# Altium schematic sheet SAMA7D65_MPU.SchDoc
size 420 x 297 mm; SheetNumber: 7; SheetTotal: 23
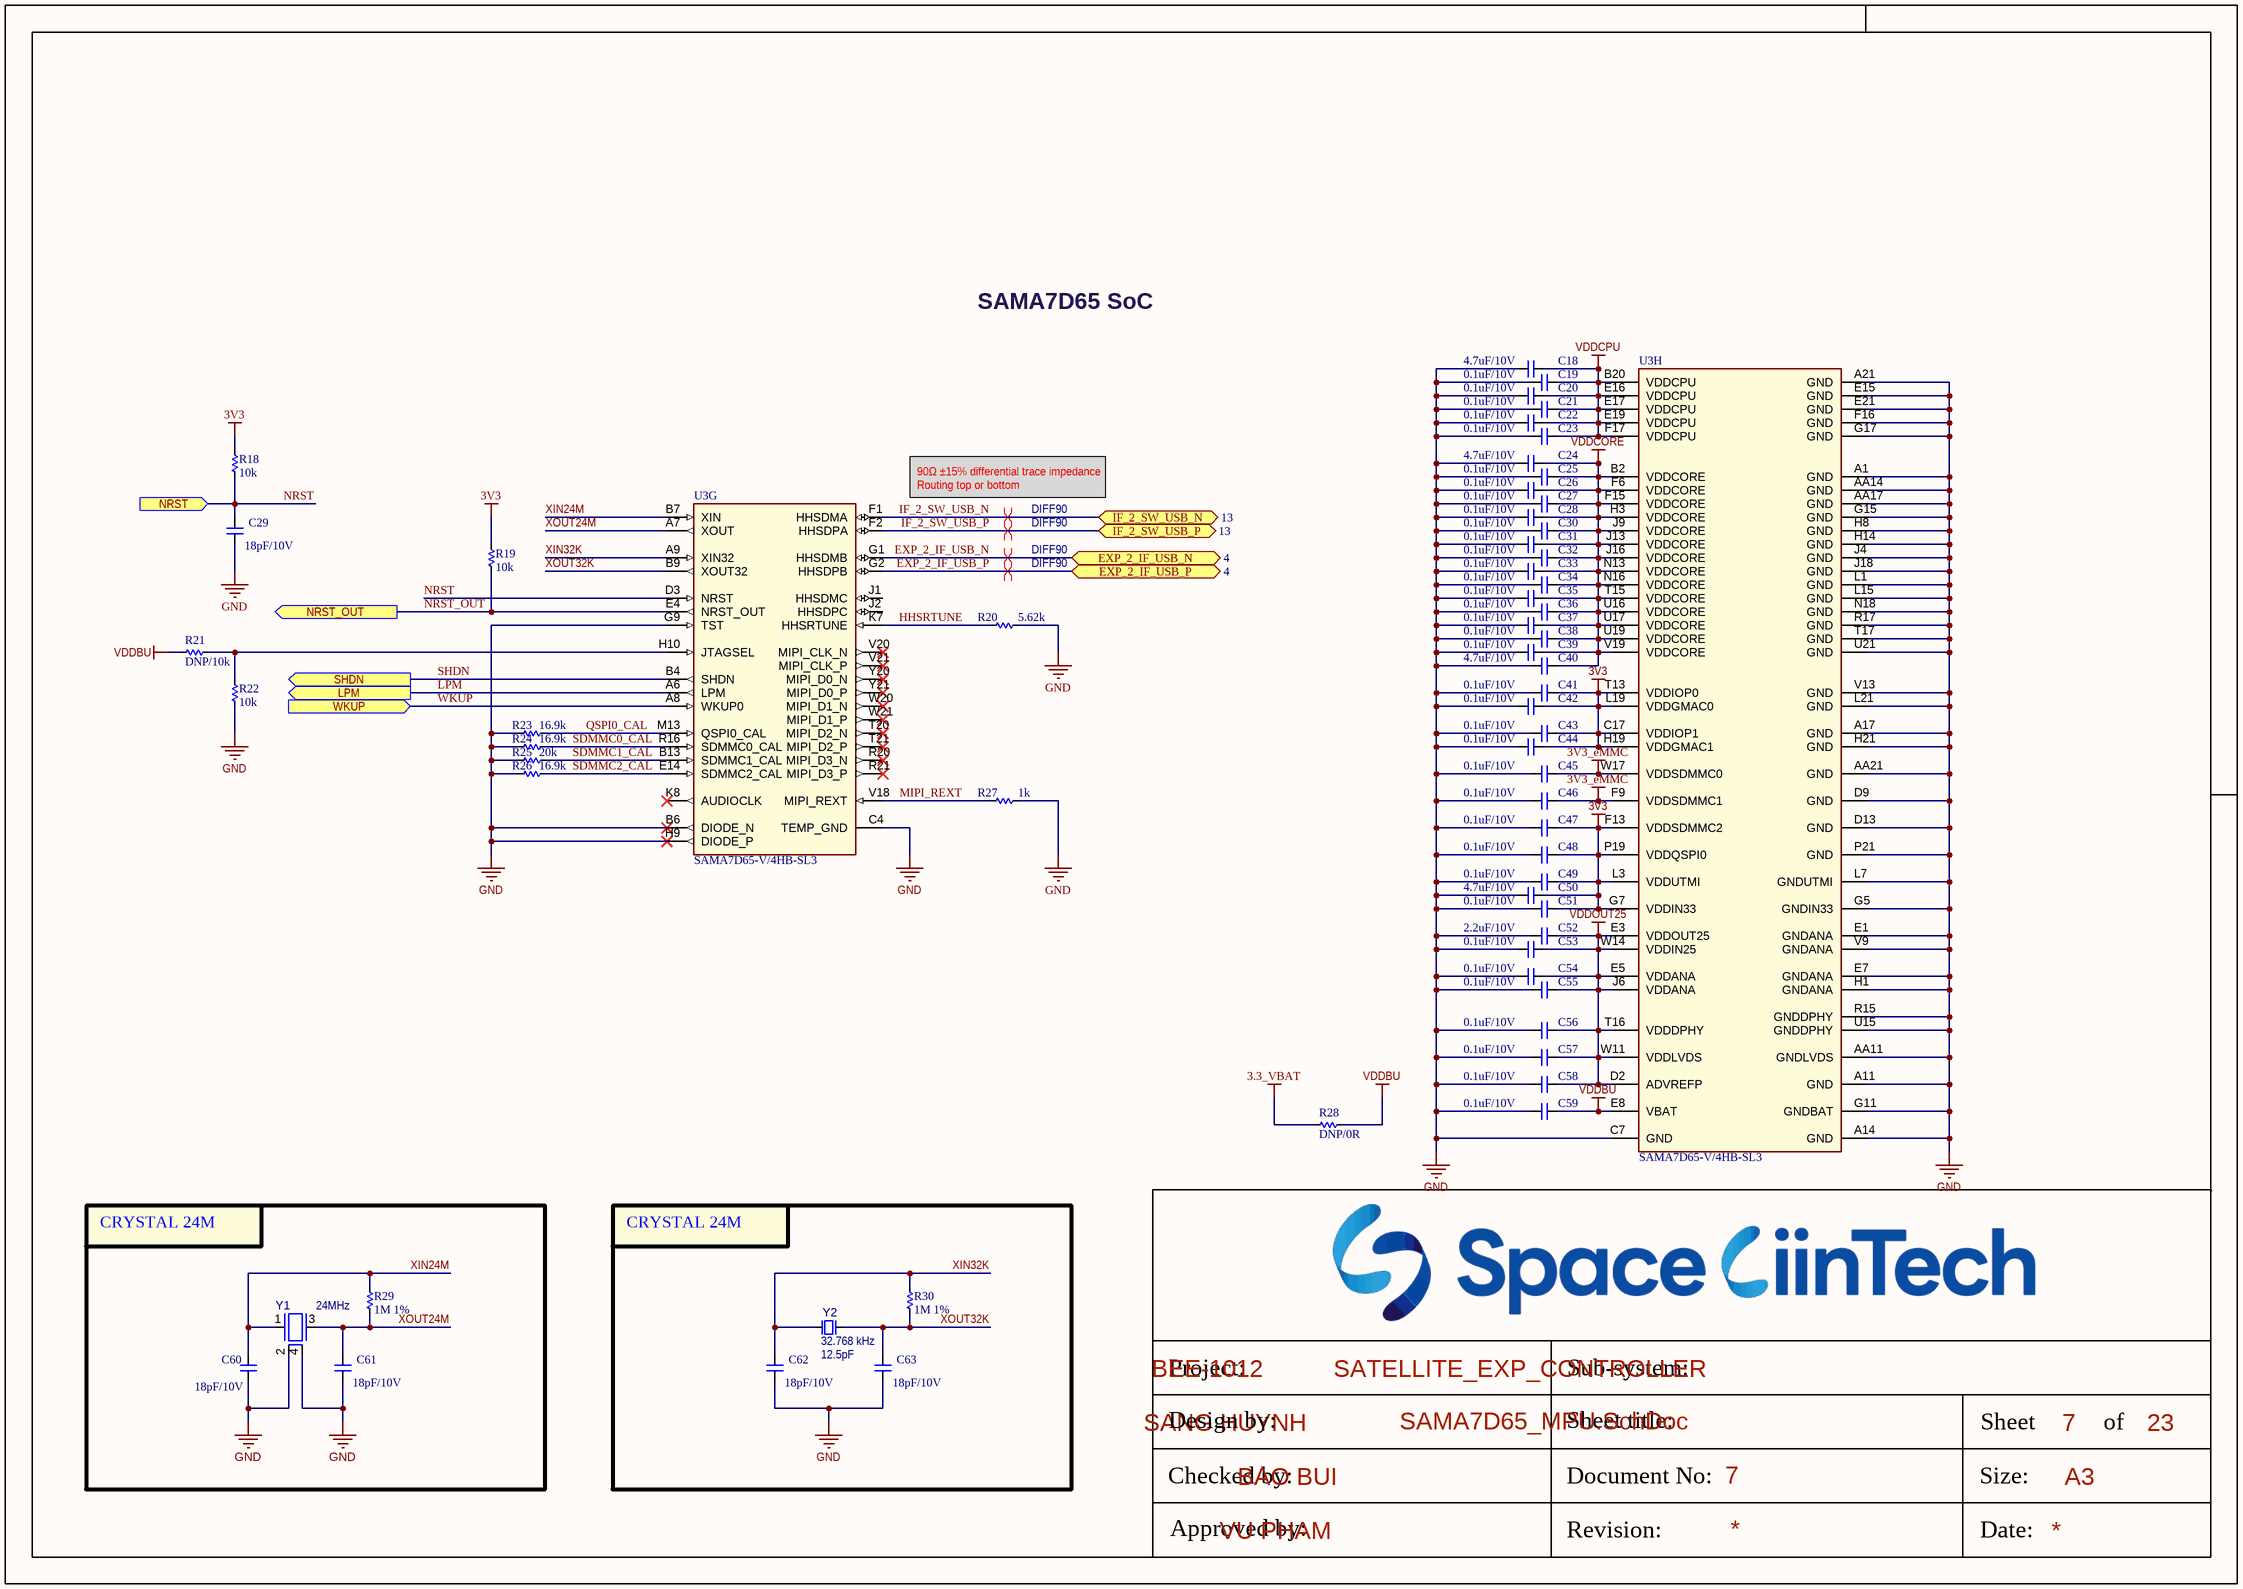
[diagram p0: SAMA7D65_MPU.SchDoc]

## Parts
C18  4.7uF/10V  [CAP_C_1005X50_L]
C19  0.1uF/10V  [CAP_C_0603x30]
C20  0.1uF/10V  [CAP_C_0603x30]
C21  0.1uF/10V  [CAP_C_0603x30]
C22  0.1uF/10V  [CAP_C_0603x30]
C23  0.1uF/10V  [CAP_C_0603x30]
C24  4.7uF/10V  [CAP_C_1005X50_L]
C25  0.1uF/10V  [CAP_C_0603x30]
C26  0.1uF/10V  [CAP_C_0603x30]
C27  0.1uF/10V  [CAP_C_0603x30]
C28  0.1uF/10V  [CAP_C_0603x30]
C29  18pF/10V  [CAP_C_0603x30]
C30  0.1uF/10V  [CAP_C_0603x30]
C31  0.1uF/10V  [CAP_C_0603x30]
C32  0.1uF/10V  [CAP_C_0603x30]
C33  0.1uF/10V  [CAP_C_0603x30]
C34  0.1uF/10V  [CAP_C_0603x30]
C35  0.1uF/10V  [CAP_C_0603x30]
C36  0.1uF/10V  [CAP_C_0603x30]
C37  0.1uF/10V  [CAP_C_0603x30]
C38  0.1uF/10V  [CAP_C_0603x30]
C39  0.1uF/10V  [CAP_C_0603x30]
C40  4.7uF/10V  [CAP_C_1005X50_L]
C41  0.1uF/10V  [CAP_C_0603x30]
C42  0.1uF/10V  [CAP_C_0603x30]
C43  0.1uF/10V  [CAP_C_0603x30]
C44  0.1uF/10V  [CAP_C_0603x30]
C45  0.1uF/10V  [CAP_C_0603x30]
C46  0.1uF/10V  [CAP_C_0603x30]
C47  0.1uF/10V  [CAP_C_0603x30]
C48  0.1uF/10V  [CAP_C_0603x30]
C49  0.1uF/10V  [CAP_C_0603x30]
C50  4.7uF/10V  [CAP_C_1005X50_L]
C51  0.1uF/10V  [CAP_C_0603x30]
C52  2.2uF/10V  [CAP_C_1005X50_L]
C53  0.1uF/10V  [CAP_C_0603x30]
C54  0.1uF/10V  [CAP_C_0603x30]
C55  0.1uF/10V  [CAP_C_0603x30]
C56  0.1uF/10V  [CAP_C_0603x30]
C57  0.1uF/10V  [CAP_C_0603x30]
C58  0.1uF/10V  [CAP_C_0603x30]
C59  0.1uF/10V  [CAP_C_0603x30]
C60  18pF/10V  [CAP_C_0603x30]
C61  18pF/10V  [CAP_C_0603x30]
C62  18pF/10V  [CAP_C_0603x30]
C63  18pF/10V  [CAP_C_0603x30]
R18  10k  [RES_C_0603X30]
R19  10k  [RES_C_0603X30]
R20  5.62k  [RES_C_0603X30]
R21  DNP/10k  [RES_C_0603X30]
R22  10k  [RES_C_0603X30]
R23  16.9k  [RES_C_0603X30]
R24  16.9k  [RES_C_0603X30]
R25  20k  [RES_C_0603X30]
R26  16.9k  [RES_C_0603X30]
R27  1k  [RES_C_0603X30]
R28  DNP/0R  [RES_C_1005x30_L]
R29  1M 1%  [RES_C_1005x30_L]
R30  1M 1%  [RES_C_1005x30_L]
U3  value SAMA7D65-V/4HB-SL3  [TFBGA-343_14x14]  (hidden comment: SAMA7D65)  (parts G,H of 8)
Y1  value 24MHz  [XTAL_ECS2401037B2JTNTR]  (hidden comment: Crystal 4 Pins)
Y2  value 32.768 kHz  Load Capacitance: 12.5pF  [CRYSTAL_FC-12M_L2.05W1.2H0.6]  (hidden comment: Crystal 2 Pins)

## Blocks framed on the sheet
CRYSTAL 24M: C60 C61 R29 Y1
CRYSTAL 24M: C62 C63 R30 Y2

## Ports
EXP_2_IF_USB_N (bidir, see 4), EXP_2_IF_USB_P (bidir, see 4), IF_2_SW_USB_N (bidir, see 13), IF_2_SW_USB_P (bidir, see 13), LPM (out, see 6), NRST (in, see 6, 17, 22), NRST_OUT (out), SHDN (out, see 6), WKUP (in, see 6)

## Nets
3.3_VBAT: R28.1
3V3: C41.2 C42.2 C43.2 C44.2 C47.2 C48.2 C49.2 C50.2 C51.2 R18.1 R19.1 U3.C17(VDDIOP1) U3.F13(VDDSDMMC2) U3.G7(VDDIN33) U3.H19(VDDGMAC1) U3.L3(VDDUTMI) U3.L19(VDDGMAC0) U3.P19(VDDQSPI0) U3.T13(VDDIOP0)
3V3_eMMC: C45.2 C46.2 U3.F9(VDDSDMMC1) U3.W17(VDDSDMMC0)
GND: C18.1 C19.1 C20.1 C21.1 C22.1 C23.1 C24.1 C25.1 C26.1 C27.1 C28.1 C29.2 C30.1 C31.1 C32.1 C33.1 C34.1 C35.1 C36.1 C37.1 C38.1 C39.1 C40.1 C41.1 C42.1 C43.1 C44.1 C45.1 C46.1 C47.1 C48.1 C49.1 C50.1 C51.1 C52.1 C53.1 C54.1 C55.1 C56.1 C57.1 C58.1 C59.1 C60.2 C61.2 C62.2 C63.2 R20.2 R22.1 R23.1 R24.1 R25.1 R26.1 R27.2 U3.A1(GND) U3.A11(GND) U3.A14(GND) U3.A17(GND) U3.A21(GND) U3.AA11(GNDLVDS) U3.AA14(GND) U3.AA17(GND) U3.AA21(GND) U3.B6(DIODE_N) U3.C4(TEMP_GND) U3.C7(GND) U3.D9(GND) U3.D13(GND) U3.E1(GNDANA) U3.E7(GNDANA) U3.E15(GND) U3.E21(GND) U3.F16(GND) U3.G5(GNDIN33) U3.G9(TST) U3.G11(GNDBAT) U3.G15(GND) U3.G17(GND) U3.H1(GNDANA) U3.H8(GND) U3.H9(DIODE_P) U3.H14(GND) U3.H21(GND) U3.J4(GND) U3.J18(GND) U3.L1(GND) U3.L7(GNDUTMI) U3.L15(GND) U3.L21(GND) U3.N18(GND) U3.P21(GND) U3.R15(GNDDPHY) U3.R17(GND) U3.T17(GND) U3.U15(GNDDPHY) U3.U21(GND) U3.V9(GNDANA) U3.V13(GND) Y1.2(GND) Y1.4(GND)
VDDBU: C59.2 R21.2 R28.2 U3.E8(VBAT)
VDDCORE: C24.2 C25.2 C26.2 C27.2 C28.2 C30.2 C31.2 C32.2 C33.2 C34.2 C35.2 C36.2 C37.2 C38.2 C39.2 C40.2 U3.B2(VDDCORE) U3.F6(VDDCORE) U3.F15(VDDCORE) U3.H3(VDDCORE) U3.J9(VDDCORE) U3.J13(VDDCORE) U3.J16(VDDCORE) U3.N13(VDDCORE) U3.N16(VDDCORE) U3.T15(VDDCORE) U3.U16(VDDCORE) U3.U17(VDDCORE) U3.U19(VDDCORE) U3.V19(VDDCORE)
VDDCPU: C18.2 C19.2 C20.2 C21.2 C22.2 C23.2 U3.B20(VDDCPU) U3.E16(VDDCPU) U3.E17(VDDCPU) U3.E19(VDDCPU) U3.F17(VDDCPU)
VDDOUT25: C52.2 C53.2 C54.2 C55.2 C56.2 C57.2 C58.2 U3.D2(ADVREFP) U3.E3(VDDOUT25) U3.E5(VDDANA) U3.J6(VDDANA) U3.T16(VDDDPHY) U3.W11(VDDLVDS) U3.W14(VDDIN25)
EXP_2_IF_USB_N: U3.G1(HHSDMB) ; port EXP_2_IF_USB_N
EXP_2_IF_USB_P: U3.G2(HHSDPB) ; port EXP_2_IF_USB_P
HHSRTUNE: R20.1 U3.K7(HHSRTUNE)
IF_2_SW_USB_N: U3.F1(HHSDMA) ; port IF_2_SW_USB_N
IF_2_SW_USB_P: U3.F2(HHSDPA) ; port IF_2_SW_USB_P
LPM: U3.A6(LPM) ; port LPM
MIPI_REXT: R27.1 U3.V18(MIPI_REXT)
NRST: C29.1 R18.2 U3.D3(NRST) ; port NRST
NRST_OUT: R19.2 U3.E4(NRST_OUT) ; port NRST_OUT
QSPI0_CAL: R23.2 U3.M13(QSPI0_CAL)
SDMMC0_CAL: R24.2 U3.R16(SDMMC0_CAL)
SDMMC1_CAL: R25.2 U3.B13(SDMMC1_CAL)
SDMMC2_CAL: R26.2 U3.E14(SDMMC2_CAL)
SHDN: U3.B4(SHDN) ; port SHDN
WKUP: U3.A8(WKUP0) ; port WKUP
XIN24M: C60.1 R29.2 U3.B7(XIN) Y1.1(Osc1)
XIN32K: C62.1 R30.2 U3.A9(XIN32) Y2.1(Osc1)
XOUT24M: C61.1 R29.1 U3.A7(XOUT) Y1.3(Osc2)
XOUT32K: C63.1 R30.1 U3.B9(XOUT32) Y2.2(Osc2)
NetR21_1: R21.1 R22.2 U3.H10(JTAGSEL)

Not connected (* = marked no-connect by the designer): U3 J1(HHSDMC) J2(HHSDPC) K8(AUDIOCLK)* R20(MIPI_D3_N)* R21(MIPI_D3_P)* T20(MIPI_D2_N)* T21(MIPI_D2_P)* V20(MIPI_CLK_N)* V21(MIPI_CLK_P)* W20(MIPI_D1_N)* W21(MIPI_D1_P)* Y20(MIPI_D0_N)* Y21(MIPI_D0_P)*

## Layout directives
differential pair; differential pair class DIFF90; net class DIFF90; rule Matched Net Lengths [Tolerance = 4mil]: EXP_2_IF_USB_N, EXP_2_IF_USB_P, IF_2_SW_USB_N, IF_2_SW_USB_P

## Notes on the sheet
- SAMA7D65 SoC
- 90Ω ±15% differential trace impedance
  Routing top or bottom
- Project:
- BEE-1012
- Sub-system:
- SATELLITE_EXP_CONTROLLER
- Design by:
- SANG HUYNH
- BAO BUI
- Sheet title:
- Sheet
- A3
- of
- Checked by:
- Approved by:
- VU PHAM
- Revision:
- Document No:
- Size:
- Date:

## Library data of the parts
C18-C63 = _CAP_C_2: CAP CHIP
R18-R30 = _RES_B_2: RES
U3 = SAMA7D65: SAMA7D65 MPU 1000MHz Cortex-A7 TFBGA-343; Manufacturer 1: Microchip Technology; Description_: MCHP MPU 32-BIT Cortex-A7 1000MHz 128kB SAMA7D65-V/4HB-SL3 TFBGA-343; Populated: YES; MCHP-ID: IC2674; Symbol: SAMA7D65-TFBGA-343; Dev Tools Status: Design; Owner: Ciprian Abramov; Restricted Sourcing: No; Manufacturer Part Number 1: SAMA7D65-V/4HB-SL3; Type: 32-Bit MPU; Status: MCL Design; Revision: 1; Category: MCHP-Microcontroller; ComponentLink1URL: https://www.microchip.com/sitesearch/search/Product%20and%20Development%20Tools/SAMA7D65-V/4HB-SL3; ComponentLink1Description: SVN Datasheet; ComponentLink2Description: Local Datasheet; ComponentLink3URL: C:\ALTIUM_WORK\00001_MCHP-CDB\Library\LibraryRefs\SAMA7D65-TFBGA-343.SchLib; ComponentLink3Description: Open Symbol; ComponentLink4URL: C:\ALTIUM_WORK\00001_MCHP-CDB\Library\Footprints\TFBGA-343_14x14.PcbLib; ComponentLink4Description: Open Footprint; ComponentLink5Description: Open Footprint 2; ComponentLink6Description: Open Footprint 3; ComponentLink7Description: Open Footprint 4; Supplier 1: Microchip Technology; Supplier Part Number 1: SAMA7D65-V/4HB-SL3; Operating Temperature: -40C to +105C; Quantity Override: 1
Y1 = ECS-240-10-37B2-JTN-TR: CRYSTAL 24 MHZ 10PF SMD; Manufacturer 1: ECS Inc; MCHP-ID: OSC1299; Description_: CRYSTAL 24MHz 10pF SMD L2W1.6H0.5; Dev Tools Status: Design; Owner: Ciprian Abramov; Tolerance: 20ppm; Populated: YES; Revision: 1; Symbol: Crystal 4 Pins; Status: MCL Design; ComponentLink1URL: https://chn-vm-apps.microchip.com/mchprepo/parts/Datasheets/ECX-1637B2.pdf; ComponentLink1Description: SVN Datasheet; ComponentLink2URL: C:\ALTIUM_WORK\00001_MCHP-CDB\Datasheets\ECX-1637B2.pdf; ComponentLink2Description: Local Datasheet; ComponentLink3URL: C:\ALTIUM_WORK\00001_MCHP-CDB\Library\LibraryRefs\Crystal 4 Pins.SchLib; ComponentLink3Description: Open Symbol; ComponentLink4URL: C:\ALTIUM_WORK\00001_MCHP-CDB\Library\Footprints\CRYSTAL_L2.0W1.6H0.5_FA-128.PcbLib; ComponentLink4Description: Open Footprint; ComponentLink5Description: Open Footprint 2; ComponentLink6Description: Open Footprint 3; ComponentLink7Description: Open Footprint 4; Operating Temperature: -40C to +85C; Package: L2.0W1.6H0.5; Type: Crystal; Category: Crystal/Oscillator; Load Capacitance: 10pF; Manufacturer Part Number 1: ECS-240-10-37B2-JTN-TR; Supplier 1: Digi-Key; Supplier Part Number 1: 50-ECS-240-10-37B2-JTN-TR-ND; Quantity Override: 1
Y2 = FC-12M 32.7680KA-A3: CRYSTAL 32.7680KHZ 12.5PF SMD; Manufacturer 1: Epson; MCHP-ID: OSC1269; Description_: CRYSTAL 32.768KHZ 12.5PF SMD 2-SMD, No Lead, FC-12M 32.7680KA-A3; Dev Tools Status: Design; Owner: Dragos Danaila; Tolerance: 20ppm; Populated: YES; Revision: 1; Symbol: Crystal 2 Pins; Status: MCL Design; ComponentLink1URL: https://chn-vm-apps.microchip.com/mchprepo/parts/Datasheets/FC-12D_en.pdf; ComponentLink1Description: SVN Datasheet; ComponentLink2URL: C:\ALTIUM_WORK\00001_MCHP-CDB\Datasheets\FC-12D_en.pdf; ComponentLink2Description: Local Datasheet; ComponentLink3URL: C:\ALTIUM_WORK\00001_MCHP-CDB\Library\LibraryRefs\Crystal 2 Pins.SchLib; ComponentLink3Description: Open Symbol; ComponentLink4URL: C:\ALTIUM_WORK\00001_MCHP-CDB\Library\Footprints\CRYSTAL_FC-12M_L2.05W1.2H0.6.PcbLib; ComponentLink4Description: Open Footprint; ComponentLink5Description: Open Footprint 2; ComponentLink6Description: Open Footprint 3; ComponentLink7Description: Open Footprint 4; Operating Temperature: -40°C ~ 85°C; Package: 2-SMD, No Lead; Type: Crystal; Category: Crystal/Oscillator; Manufacturer Part Number 1: FC-12M 32.7680KA-A3; Supplier 1: Digikey; Supplier Part Number 1: SER3672CT-ND; Quantity Override: 1